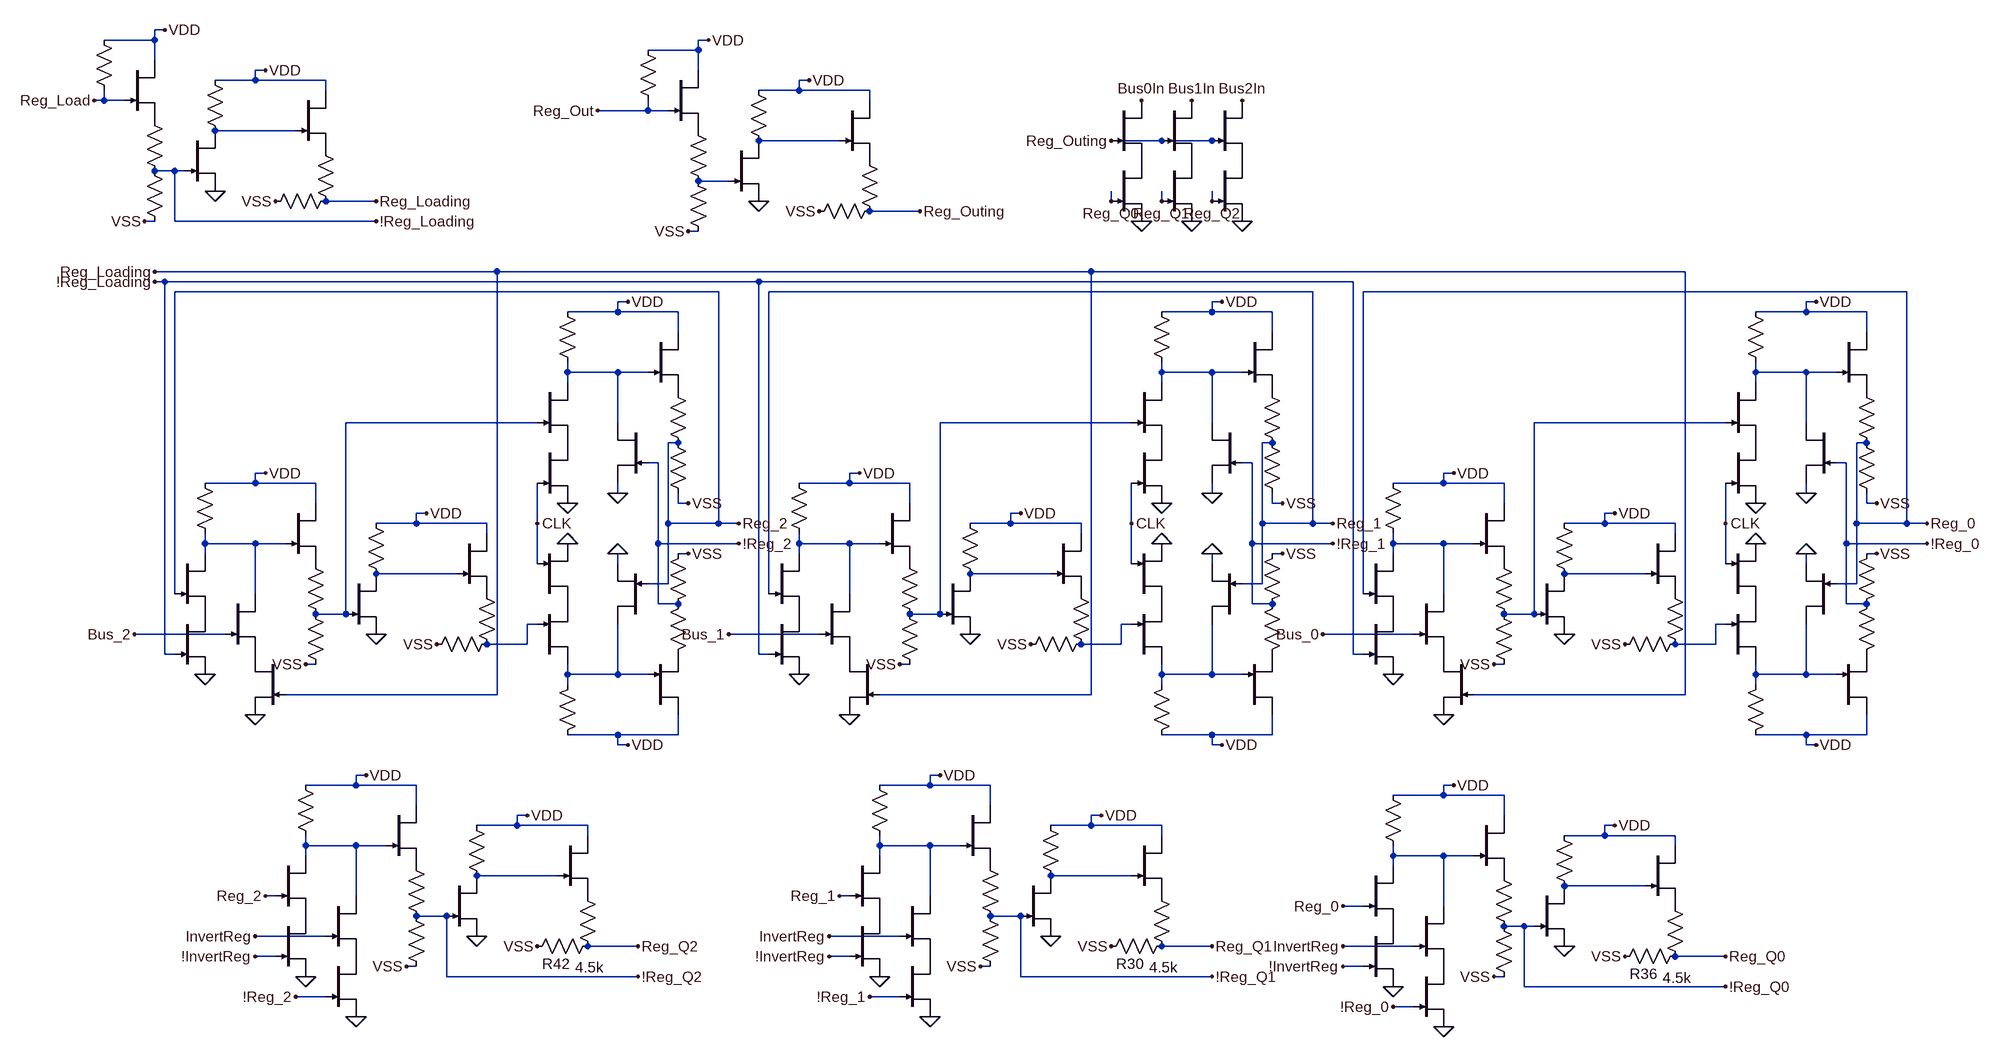
[diagram p0: schematic invertible register 3 bit.asc]
invertible register 3 bit.asc, the LTspice schematic file:
Version 4.1
SHEET 1 109444 42780
WIRE -5680 -1200 -5696 -1200
WIRE -5696 -1184 -5696 -1200
WIRE -5696 -1184 -5776 -1184
WIRE -4816 -1184 -4832 -1184
WIRE -4832 -1168 -4832 -1184
WIRE -4832 -1168 -4912 -1168
WIRE -5696 -1152 -5696 -1184
WIRE -5520 -1136 -5536 -1136
WIRE -4832 -1136 -4832 -1168
WIRE -5536 -1120 -5536 -1136
WIRE -5536 -1120 -5600 -1120
WIRE -5424 -1120 -5536 -1120
WIRE -4656 -1120 -4672 -1120
WIRE -5424 -1104 -5424 -1120
WIRE -4672 -1104 -4672 -1120
WIRE -4672 -1104 -4736 -1104
WIRE -4560 -1104 -4672 -1104
WIRE -5776 -1088 -5776 -1104
WIRE -5776 -1088 -5792 -1088
WIRE -5744 -1088 -5776 -1088
WIRE -4560 -1088 -4560 -1104
WIRE -4912 -1072 -4912 -1088
WIRE -4912 -1072 -4992 -1072
WIRE -4880 -1072 -4912 -1072
WIRE -5472 -1040 -5600 -1040
WIRE -4608 -1024 -4736 -1024
WIRE -4096 -1024 -4176 -1024
WIRE -4016 -1024 -4096 -1024
WIRE -4000 -1024 -4016 -1024
WIRE -5664 -976 -5696 -976
WIRE -5648 -976 -5664 -976
WIRE -4784 -960 -4832 -960
WIRE -5344 -928 -5424 -928
WIRE -4176 -928 -4176 -944
WIRE -4096 -928 -4096 -944
WIRE -4016 -928 -4016 -944
WIRE -4480 -912 -4560 -912
WIRE -5696 -896 -5712 -896
WIRE -5664 -896 -5664 -976
WIRE -5344 -896 -5664 -896
WIRE -4832 -880 -4848 -880
WIRE -5152 -816 -5696 -816
WIRE -4208 -816 -5152 -816
WIRE -3264 -816 -4208 -816
WIRE -5680 -800 -5696 -800
WIRE -4736 -800 -5680 -800
WIRE -3792 -800 -4736 -800
WIRE -4800 -784 -5664 -784
WIRE -3856 -784 -4720 -784
WIRE -2912 -784 -3776 -784
WIRE -4944 -768 -4960 -768
WIRE -4000 -768 -4016 -768
WIRE -3056 -768 -3072 -768
WIRE -4960 -752 -4960 -768
WIRE -4960 -752 -5040 -752
WIRE -4864 -752 -4960 -752
WIRE -4016 -752 -4016 -768
WIRE -4016 -752 -4096 -752
WIRE -3920 -752 -4016 -752
WIRE -3072 -752 -3072 -768
WIRE -3072 -752 -3152 -752
WIRE -2976 -752 -3072 -752
WIRE -4864 -720 -4864 -752
WIRE -3920 -720 -3920 -752
WIRE -2976 -720 -2976 -752
WIRE -5040 -656 -5040 -672
WIRE -4960 -656 -5040 -656
WIRE -4912 -656 -4960 -656
WIRE -4096 -656 -4096 -672
WIRE -4016 -656 -4096 -656
WIRE -3968 -656 -4016 -656
WIRE -3152 -656 -3152 -672
WIRE -3072 -656 -3152 -656
WIRE -3024 -656 -3072 -656
WIRE -5040 -640 -5040 -656
WIRE -4096 -640 -4096 -656
WIRE -3152 -640 -3152 -656
WIRE -5088 -576 -5392 -576
WIRE -4960 -576 -4960 -656
WIRE -4144 -576 -4448 -576
WIRE -4016 -576 -4016 -656
WIRE -3200 -576 -3504 -576
WIRE -3072 -576 -3072 -656
WIRE -4864 -544 -4880 -544
WIRE -3920 -544 -3936 -544
WIRE -2976 -544 -2992 -544
WIRE -4896 -512 -4912 -512
WIRE -3952 -512 -3968 -512
WIRE -3008 -512 -3024 -512
WIRE -5520 -496 -5536 -496
WIRE -4576 -496 -4592 -496
WIRE -3632 -496 -3648 -496
WIRE -5536 -480 -5536 -496
WIRE -5536 -480 -5616 -480
WIRE -5440 -480 -5536 -480
WIRE -4592 -480 -4592 -496
WIRE -4592 -480 -4672 -480
WIRE -4496 -480 -4592 -480
WIRE -3648 -480 -3648 -496
WIRE -3648 -480 -3728 -480
WIRE -3552 -480 -3648 -480
WIRE -4960 -464 -4960 -480
WIRE -4016 -464 -4016 -480
WIRE -3072 -464 -3072 -480
WIRE -5440 -448 -5440 -480
WIRE -4864 -448 -4864 -464
WIRE -4848 -448 -4864 -448
WIRE -4496 -448 -4496 -480
WIRE -3920 -448 -3920 -464
WIRE -3904 -448 -3920 -448
WIRE -3552 -448 -3552 -480
WIRE -2976 -448 -2976 -464
WIRE -2960 -448 -2976 -448
WIRE -5264 -432 -5280 -432
WIRE -4320 -432 -4336 -432
WIRE -3376 -432 -3392 -432
WIRE -5280 -416 -5280 -432
WIRE -5280 -416 -5344 -416
WIRE -5168 -416 -5280 -416
WIRE -5088 -416 -5088 -480
WIRE -4880 -416 -4880 -544
WIRE -4800 -416 -4800 -784
WIRE -4800 -416 -4880 -416
WIRE -4768 -416 -4800 -416
WIRE -4336 -416 -4336 -432
WIRE -4336 -416 -4400 -416
WIRE -4224 -416 -4336 -416
WIRE -4144 -416 -4144 -480
WIRE -3936 -416 -3936 -544
WIRE -3856 -416 -3856 -784
WIRE -3856 -416 -3936 -416
WIRE -3824 -416 -3856 -416
WIRE -3392 -416 -3392 -432
WIRE -3392 -416 -3456 -416
WIRE -3280 -416 -3392 -416
WIRE -3200 -416 -3200 -480
WIRE -2992 -416 -2992 -544
WIRE -2912 -416 -2912 -784
WIRE -2912 -416 -2992 -416
WIRE -2880 -416 -2912 -416
WIRE -5168 -400 -5168 -416
WIRE -4224 -400 -4224 -416
WIRE -3280 -400 -3280 -416
WIRE -5616 -384 -5616 -400
WIRE -5536 -384 -5616 -384
WIRE -5488 -384 -5536 -384
WIRE -4896 -384 -4896 -512
WIRE -4768 -384 -4896 -384
WIRE -4672 -384 -4672 -400
WIRE -4592 -384 -4672 -384
WIRE -4544 -384 -4592 -384
WIRE -3952 -384 -3952 -512
WIRE -3824 -384 -3952 -384
WIRE -3728 -384 -3728 -400
WIRE -3648 -384 -3728 -384
WIRE -3600 -384 -3648 -384
WIRE -3008 -384 -3008 -512
WIRE -2880 -384 -3008 -384
WIRE -5616 -368 -5616 -384
WIRE -4848 -368 -4864 -368
WIRE -4672 -368 -4672 -384
WIRE -3904 -368 -3920 -368
WIRE -3728 -368 -3728 -384
WIRE -2960 -368 -2976 -368
WIRE -5088 -352 -5088 -416
WIRE -4960 -352 -4960 -368
WIRE -4144 -352 -4144 -416
WIRE -4016 -352 -4016 -368
WIRE -3200 -352 -3200 -416
WIRE -3072 -352 -3072 -368
WIRE -5216 -336 -5344 -336
WIRE -4272 -336 -4400 -336
WIRE -3328 -336 -3456 -336
WIRE -4880 -320 -4880 -416
WIRE -4880 -320 -4912 -320
WIRE -3936 -320 -3936 -416
WIRE -3936 -320 -3968 -320
WIRE -2992 -320 -2992 -416
WIRE -2992 -320 -3024 -320
WIRE -5664 -304 -5664 -784
WIRE -5536 -304 -5536 -384
WIRE -4720 -304 -4720 -784
WIRE -4592 -304 -4592 -384
WIRE -3776 -304 -3776 -784
WIRE -3648 -304 -3648 -384
WIRE -4896 -288 -4896 -384
WIRE -4864 -288 -4896 -288
WIRE -3952 -288 -3952 -384
WIRE -3920 -288 -3952 -288
WIRE -3008 -288 -3008 -384
WIRE -2976 -288 -3008 -288
WIRE -5392 -272 -5392 -576
WIRE -5392 -272 -5440 -272
WIRE -4448 -272 -4448 -576
WIRE -4448 -272 -4496 -272
WIRE -3504 -272 -3504 -576
WIRE -3504 -272 -3552 -272
WIRE -5088 -256 -5104 -256
WIRE -4144 -256 -4160 -256
WIRE -3200 -256 -3216 -256
WIRE -5584 -240 -5728 -240
WIRE -4640 -240 -4784 -240
WIRE -3696 -240 -3840 -240
WIRE -5104 -224 -5104 -256
WIRE -5104 -224 -5168 -224
WIRE -4160 -224 -4160 -256
WIRE -4160 -224 -4224 -224
WIRE -3216 -224 -3216 -256
WIRE -3216 -224 -3280 -224
WIRE -5680 -208 -5680 -800
WIRE -5664 -208 -5680 -208
WIRE -4736 -208 -4736 -800
WIRE -4720 -208 -4736 -208
WIRE -3792 -208 -3792 -800
WIRE -3776 -208 -3792 -208
WIRE -5440 -192 -5456 -192
WIRE -4496 -192 -4512 -192
WIRE -3552 -192 -3568 -192
WIRE -5040 -176 -5040 -192
WIRE -4960 -176 -4960 -256
WIRE -4960 -176 -5040 -176
WIRE -4912 -176 -4960 -176
WIRE -4096 -176 -4096 -192
WIRE -4016 -176 -4016 -256
WIRE -4016 -176 -4096 -176
WIRE -3968 -176 -4016 -176
WIRE -3152 -176 -3152 -192
WIRE -3072 -176 -3072 -256
WIRE -3072 -176 -3152 -176
WIRE -3024 -176 -3072 -176
WIRE -5040 -160 -5040 -176
WIRE -4096 -160 -4096 -176
WIRE -3152 -160 -3152 -176
WIRE -5152 -144 -5152 -816
WIRE -5152 -144 -5488 -144
WIRE -4208 -144 -4208 -816
WIRE -4208 -144 -4544 -144
WIRE -3264 -144 -3264 -816
WIRE -3264 -144 -3600 -144
WIRE -4960 -80 -5040 -80
WIRE -4864 -80 -4864 -112
WIRE -4864 -80 -4960 -80
WIRE -4016 -80 -4096 -80
WIRE -3920 -80 -3920 -112
WIRE -3920 -80 -4016 -80
WIRE -3072 -80 -3152 -80
WIRE -2976 -80 -2976 -112
WIRE -2976 -80 -3072 -80
WIRE -4960 -64 -4960 -80
WIRE -4944 -64 -4960 -64
WIRE -4016 -64 -4016 -80
WIRE -4000 -64 -4016 -64
WIRE -3072 -64 -3072 -80
WIRE -3056 -64 -3072 -64
WIRE -5360 -16 -5376 -16
WIRE -4448 -16 -4464 -16
WIRE -5376 0 -5376 -16
WIRE -5376 0 -5456 0
WIRE -5280 0 -5376 0
WIRE -4464 0 -4464 -16
WIRE -4464 0 -4544 0
WIRE -4368 0 -4464 0
WIRE -3632 0 -3648 0
WIRE -3648 16 -3648 0
WIRE -3648 16 -3728 16
WIRE -3552 16 -3648 16
WIRE -5280 32 -5280 0
WIRE -4368 32 -4368 0
WIRE -5104 48 -5120 48
WIRE -4192 48 -4208 48
WIRE -3552 48 -3552 16
WIRE -5120 64 -5120 48
WIRE -5120 64 -5184 64
WIRE -5008 64 -5120 64
WIRE -4208 64 -4208 48
WIRE -4208 64 -4272 64
WIRE -4096 64 -4208 64
WIRE -3376 64 -3392 64
WIRE -5008 80 -5008 64
WIRE -4096 80 -4096 64
WIRE -3392 80 -3392 64
WIRE -3392 80 -3456 80
WIRE -3280 80 -3392 80
WIRE -5456 96 -5456 80
WIRE -5376 96 -5456 96
WIRE -5328 96 -5376 96
WIRE -4544 96 -4544 80
WIRE -4464 96 -4544 96
WIRE -4416 96 -4464 96
WIRE -3280 96 -3280 80
WIRE -5456 112 -5456 96
WIRE -4544 112 -4544 96
WIRE -3728 112 -3728 96
WIRE -3648 112 -3728 112
WIRE -3600 112 -3648 112
WIRE -3728 128 -3728 112
WIRE -5056 144 -5184 144
WIRE -4144 144 -4272 144
WIRE -3328 160 -3456 160
WIRE -5504 176 -5520 176
WIRE -5376 176 -5376 96
WIRE -4592 176 -4608 176
WIRE -4464 176 -4464 96
WIRE -3776 192 -3808 192
WIRE -3648 192 -3648 112
WIRE -5232 208 -5280 208
WIRE -4320 208 -4368 208
WIRE -3520 224 -3552 224
WIRE -3504 224 -3520 224
WIRE -5424 240 -5536 240
WIRE -4512 240 -4624 240
WIRE -4928 256 -5008 256
WIRE -4016 256 -4096 256
WIRE -3696 256 -3808 256
WIRE -5504 272 -5536 272
WIRE -4592 272 -4624 272
WIRE -3200 272 -3280 272
WIRE -5280 288 -5296 288
WIRE -4368 288 -4384 288
WIRE -3776 288 -3808 288
WIRE -5232 304 -5232 208
WIRE -4928 304 -5232 304
WIRE -4320 304 -4320 208
WIRE -4016 304 -4320 304
WIRE -3552 304 -3568 304
WIRE -3520 320 -3520 224
WIRE -3200 320 -3520 320
WIRE -5424 336 -5472 336
WIRE -4512 336 -4560 336
WIRE -3696 352 -3728 352
FLAG -5600 -944 0
FLAG -5680 -1200 VDD
FLAG -5520 -1136 VDD
FLAG -5712 -896 VSS
FLAG -5504 -928 VSS
FLAG -4736 -928 0
FLAG -4816 -1184 VDD
FLAG -4656 -1120 VDD
FLAG -4848 -880 VSS
FLAG -4640 -912 VSS
FLAG -4944 -768 VDD
FLAG -4944 -64 VDD
FLAG -4848 -368 VSS
FLAG -5040 -384 0
FLAG -5040 -448 0
FLAG -4960 -464 0
FLAG -4960 -368 0
FLAG -4848 -448 VSS
FLAG -5088 -416 CLK
FLAG -5536 -112 0
FLAG -5616 -176 0
FLAG -5344 -240 0
FLAG -5520 -496 VDD
FLAG -5264 -432 VDD
FLAG -5456 -192 VSS
FLAG -5248 -224 VSS
FLAG -5728 -240 Bus_2
FLAG -5696 -816 Reg_Loading
FLAG -5344 -928 Reg_Loading
FLAG -5344 -896 !Reg_Loading
FLAG -5696 -800 !Reg_Loading
FLAG -4768 -416 Reg_2
FLAG -5792 -1088 Reg_Load
FLAG -4992 -1072 Reg_Out
FLAG -4480 -912 Reg_Outing
FLAG -4768 -384 !Reg_2
FLAG -4000 -768 VDD
FLAG -4000 -64 VDD
FLAG -3904 -368 VSS
FLAG -4096 -384 0
FLAG -4096 -448 0
FLAG -4016 -464 0
FLAG -4016 -368 0
FLAG -3904 -448 VSS
FLAG -4144 -416 CLK
FLAG -4592 -112 0
FLAG -4672 -176 0
FLAG -4400 -240 0
FLAG -4576 -496 VDD
FLAG -4320 -432 VDD
FLAG -4512 -192 VSS
FLAG -4304 -224 VSS
FLAG -4784 -240 Bus_1
FLAG -3824 -416 Reg_1
FLAG -3824 -384 !Reg_1
FLAG -3056 -768 VDD
FLAG -3056 -64 VDD
FLAG -2960 -368 VSS
FLAG -3152 -384 0
FLAG -3152 -448 0
FLAG -3072 -464 0
FLAG -3072 -368 0
FLAG -2960 -448 VSS
FLAG -3200 -416 CLK
FLAG -3648 -112 0
FLAG -3728 -176 0
FLAG -3456 -240 0
FLAG -3632 -496 VDD
FLAG -3376 -432 VDD
FLAG -3568 -192 VSS
FLAG -3360 -224 VSS
FLAG -3840 -240 Bus_0
FLAG -2880 -416 Reg_0
FLAG -2880 -384 !Reg_0
FLAG -4128 -896 0
FLAG -4128 -1088 Bus0In
FLAG -4176 -1024 Reg_Outing
FLAG -4048 -896 0
FLAG -4048 -1088 Bus1In
FLAG -3968 -896 0
FLAG -3968 -1088 Bus2In
FLAG -4464 368 0
FLAG -4544 304 0
FLAG -4272 240 0
FLAG -4448 -16 VDD
FLAG -4192 48 VDD
FLAG -4384 288 VSS
FLAG -4176 256 VSS
FLAG -4624 240 InvertReg
FLAG -3648 384 0
FLAG -3728 320 0
FLAG -3456 256 0
FLAG -3632 0 VDD
FLAG -3376 64 VDD
FLAG -3568 304 VSS
FLAG -3360 272 VSS
FLAG -3808 288 !InvertReg
FLAG -4608 176 Reg_1
FLAG -4016 256 Reg_Q1
FLAG -3200 272 Reg_Q0
FLAG -3200 320 !Reg_Q0
FLAG -4016 304 !Reg_Q1
FLAG -4560 336 !Reg_1
FLAG -3808 192 Reg_0
FLAG -3728 352 !Reg_0
FLAG -3808 256 InvertReg
FLAG -4624 272 !InvertReg
FLAG -5376 368 0
FLAG -5456 304 0
FLAG -5184 240 0
FLAG -5360 -16 VDD
FLAG -5104 48 VDD
FLAG -5296 288 VSS
FLAG -5088 256 VSS
FLAG -5536 240 InvertReg
FLAG -5520 176 Reg_2
FLAG -4928 256 Reg_Q2
FLAG -4928 304 !Reg_Q2
FLAG -5472 336 !Reg_2
FLAG -5536 272 !InvertReg
FLAG -4176 -928 Reg_Q0
FLAG -4096 -928 Reg_Q1
FLAG -4016 -928 Reg_Q2
SYMBOL res -5792 -1200 R0
WINDOW 0 -35 57 Invisible 2
WINDOW 3 34 56 Invisible 2
SYMATTR InstName R3457
SYMATTR Value 100k
SYMBOL njf -5744 -1152 R0
WINDOW 0 56 32 Invisible 2
WINDOW 3 56 72 Invisible 2
SYMATTR InstName J_F881
SYMATTR Value DR
SYMBOL res -5712 -1072 R0
WINDOW 0 -24 60 Invisible 2
WINDOW 3 34 58 Invisible 2
SYMATTR InstName R3458
SYMATTR Value 1k
SYMBOL res -5712 -992 R0
WINDOW 0 -22 62 Invisible 2
WINDOW 3 37 62 Invisible 2
SYMATTR InstName R3459
SYMATTR Value 4.8k
SYMBOL njf -5648 -1040 R0
WINDOW 0 56 32 Invisible 2
WINDOW 3 56 72 Invisible 2
SYMATTR InstName J_A2131
SYMATTR Value DR
SYMBOL res -5616 -1136 R0
WINDOW 0 56 32 Invisible 2
WINDOW 3 56 72 Invisible 2
SYMATTR InstName R3460
SYMATTR Value 50k
SYMBOL njf -5472 -1104 R0
WINDOW 0 56 32 Invisible 2
WINDOW 3 56 72 Invisible 2
SYMATTR InstName J_A2132
SYMATTR Value DR
SYMBOL res -5440 -1024 R0
WINDOW 0 37 24 Invisible 2
WINDOW 3 -30 25 Invisible 2
SYMATTR InstName R3461
SYMATTR Value 1k
SYMBOL res -5408 -944 R90
WINDOW 0 59 66 Invisible 2
WINDOW 3 34 13 Invisible 2
SYMATTR InstName R3462
SYMATTR Value 4.5k
SYMBOL res -4928 -1184 R0
WINDOW 0 -35 57 Invisible 2
WINDOW 3 34 56 Invisible 2
SYMATTR InstName R3463
SYMATTR Value 100k
SYMBOL njf -4880 -1136 R0
WINDOW 0 56 32 Invisible 2
WINDOW 3 56 72 Invisible 2
SYMATTR InstName J_F882
SYMATTR Value DR
SYMBOL res -4848 -1056 R0
WINDOW 0 -24 60 Invisible 2
WINDOW 3 34 58 Invisible 2
SYMATTR InstName R3464
SYMATTR Value 1k
SYMBOL res -4848 -976 R0
WINDOW 0 -22 62 Invisible 2
WINDOW 3 37 62 Invisible 2
SYMATTR InstName R3465
SYMATTR Value 4.8k
SYMBOL njf -4784 -1024 R0
WINDOW 0 56 32 Invisible 2
WINDOW 3 56 72 Invisible 2
SYMATTR InstName J_A2133
SYMATTR Value DR
SYMBOL res -4752 -1120 R0
WINDOW 0 56 32 Invisible 2
WINDOW 3 56 72 Invisible 2
SYMATTR InstName R3466
SYMATTR Value 50k
SYMBOL njf -4608 -1088 R0
WINDOW 0 56 32 Invisible 2
WINDOW 3 56 72 Invisible 2
SYMATTR InstName J_A2134
SYMATTR Value DR
SYMBOL res -4576 -1008 R0
WINDOW 0 37 24 Invisible 2
WINDOW 3 -30 25 Invisible 2
SYMATTR InstName R3467
SYMATTR Value 1k
SYMBOL res -4544 -928 R90
WINDOW 0 59 66 Invisible 2
WINDOW 3 34 13 Invisible 2
SYMATTR InstName R3468
SYMATTR Value 4.5k
SYMBOL njf -5088 -640 R0
WINDOW 0 56 32 Invisible 2
WINDOW 3 56 72 Invisible 2
SYMATTR InstName J_A2135
SYMATTR Value DR
SYMBOL res -5056 -768 R0
WINDOW 0 -35 57 Invisible 2
WINDOW 3 34 56 Invisible 2
SYMATTR InstName R3469
SYMATTR Value 100k
SYMBOL njf -4912 -720 R0
WINDOW 0 56 32 Invisible 2
WINDOW 3 56 72 Invisible 2
SYMATTR InstName J_F883
SYMATTR Value DR
SYMBOL res -4880 -640 R0
WINDOW 0 -24 60 Invisible 2
WINDOW 3 34 58 Invisible 2
SYMATTR InstName R3470
SYMATTR Value 1k
SYMBOL res -4880 -560 R0
WINDOW 0 -22 62 Invisible 2
WINDOW 3 37 62 Invisible 2
SYMATTR InstName R3471
SYMATTR Value 4.8k
SYMBOL njf -4912 -576 M0
WINDOW 0 11 -7 Invisible 2
WINDOW 3 56 72 Invisible 2
SYMATTR InstName J_B1002
SYMATTR Value DR
SYMBOL njf -5088 -192 M180
WINDOW 0 56 32 Invisible 2
WINDOW 3 56 72 Invisible 2
SYMATTR InstName J_A2136
SYMATTR Value DR
SYMBOL res -5056 -64 M180
WINDOW 0 36 76 Invisible 2
WINDOW 3 36 40 Invisible 2
SYMATTR InstName R3472
SYMATTR Value 100k
SYMBOL njf -4912 -112 M180
WINDOW 0 56 32 Invisible 2
WINDOW 3 56 72 Invisible 2
SYMATTR InstName J_F884
SYMATTR Value DR
SYMBOL res -4880 -192 M180
WINDOW 0 36 76 Invisible 2
WINDOW 3 36 40 Invisible 2
SYMATTR InstName R3473
SYMATTR Value 1k
SYMBOL res -4880 -272 M180
WINDOW 0 36 76 Invisible 2
WINDOW 3 36 40 Invisible 2
SYMATTR InstName R3474
SYMATTR Value 4.8k
SYMBOL njf -4912 -256 R180
WINDOW 0 56 32 Invisible 2
WINDOW 3 56 72 Invisible 2
SYMATTR InstName J_B1003
SYMATTR Value DR
SYMBOL njf -5088 -544 R0
WINDOW 0 56 32 Invisible 2
WINDOW 3 56 72 Invisible 2
SYMATTR InstName J_A2137
SYMATTR Value DR
SYMBOL njf -5088 -288 M180
WINDOW 0 56 32 Invisible 2
WINDOW 3 56 72 Invisible 2
SYMATTR InstName J_A2138
SYMATTR Value DR
SYMBOL njf -5664 -368 R0
WINDOW 0 56 32 Invisible 2
WINDOW 3 56 72 Invisible 2
SYMATTR InstName J_A2139
SYMATTR Value DR
SYMBOL res -5632 -496 R0
WINDOW 0 -35 57 Invisible 2
WINDOW 3 34 56 Invisible 2
SYMATTR InstName R3475
SYMATTR Value 100k
SYMBOL njf -5488 -448 R0
WINDOW 0 56 32 Invisible 2
WINDOW 3 56 72 Invisible 2
SYMATTR InstName J_F885
SYMATTR Value DR
SYMBOL res -5456 -368 R0
WINDOW 0 -24 60 Invisible 2
WINDOW 3 34 58 Invisible 2
SYMATTR InstName R3476
SYMATTR Value 1k
SYMBOL res -5456 -288 R0
WINDOW 0 -22 62 Invisible 2
WINDOW 3 37 62 Invisible 2
SYMATTR InstName R3477
SYMATTR Value 4.8k
SYMBOL njf -5584 -304 R0
WINDOW 0 56 32 Invisible 2
WINDOW 3 56 72 Invisible 2
SYMATTR InstName J_B1004
SYMATTR Value DR
SYMBOL njf -5392 -336 R0
WINDOW 0 56 32 Invisible 2
WINDOW 3 56 72 Invisible 2
SYMATTR InstName J_A2140
SYMATTR Value DR
SYMBOL res -5360 -432 R0
WINDOW 0 56 32 Invisible 2
WINDOW 3 56 72 Invisible 2
SYMATTR InstName R3478
SYMATTR Value 50k
SYMBOL njf -5216 -400 R0
WINDOW 0 56 32 Invisible 2
WINDOW 3 56 72 Invisible 2
SYMATTR InstName J_A2141
SYMATTR Value DR
SYMBOL res -5184 -320 R0
WINDOW 0 37 24 Invisible 2
WINDOW 3 -30 25 Invisible 2
SYMATTR InstName R3479
SYMATTR Value 1k
SYMBOL res -5152 -240 R90
WINDOW 0 59 66 Invisible 2
WINDOW 3 34 13 Invisible 2
SYMATTR InstName R3480
SYMATTR Value 4.5k
SYMBOL njf -5664 -272 R0
WINDOW 0 56 32 Invisible 2
WINDOW 3 56 72 Invisible 2
SYMATTR InstName J_A2142
SYMATTR Value DR
SYMBOL njf -5488 -208 M0
WINDOW 0 56 32 Invisible 2
WINDOW 3 56 72 Invisible 2
SYMATTR InstName J_B1005
SYMATTR Value DR
SYMBOL njf -4144 -640 R0
WINDOW 0 56 32 Invisible 2
WINDOW 3 56 72 Invisible 2
SYMATTR InstName J_A1
SYMATTR Value DR
SYMBOL res -4112 -768 R0
WINDOW 0 -35 57 Invisible 2
WINDOW 3 34 56 Invisible 2
SYMATTR InstName R1
SYMATTR Value 100k
SYMBOL njf -3968 -720 R0
WINDOW 0 56 32 Invisible 2
WINDOW 3 56 72 Invisible 2
SYMATTR InstName J_F1
SYMATTR Value DR
SYMBOL res -3936 -640 R0
WINDOW 0 -24 60 Invisible 2
WINDOW 3 34 58 Invisible 2
SYMATTR InstName R2
SYMATTR Value 1k
SYMBOL res -3936 -560 R0
WINDOW 0 -22 62 Invisible 2
WINDOW 3 37 62 Invisible 2
SYMATTR InstName R3
SYMATTR Value 4.8k
SYMBOL njf -3968 -576 M0
WINDOW 0 11 -7 Invisible 2
WINDOW 3 56 72 Invisible 2
SYMATTR InstName J_B1
SYMATTR Value DR
SYMBOL njf -4144 -192 M180
WINDOW 0 56 32 Invisible 2
WINDOW 3 56 72 Invisible 2
SYMATTR InstName J_A2
SYMATTR Value DR
SYMBOL res -4112 -64 M180
WINDOW 0 36 76 Invisible 2
WINDOW 3 36 40 Invisible 2
SYMATTR InstName R4
SYMATTR Value 100k
SYMBOL njf -3968 -112 M180
WINDOW 0 56 32 Invisible 2
WINDOW 3 56 72 Invisible 2
SYMATTR InstName J_F2
SYMATTR Value DR
SYMBOL res -3936 -192 M180
WINDOW 0 36 76 Invisible 2
WINDOW 3 36 40 Invisible 2
SYMATTR InstName R5
SYMATTR Value 1k
SYMBOL res -3936 -272 M180
WINDOW 0 36 76 Invisible 2
WINDOW 3 36 40 Invisible 2
SYMATTR InstName R6
SYMATTR Value 4.8k
SYMBOL njf -3968 -256 R180
WINDOW 0 56 32 Invisible 2
WINDOW 3 56 72 Invisible 2
SYMATTR InstName J_B2
SYMATTR Value DR
SYMBOL njf -4144 -544 R0
WINDOW 0 56 32 Invisible 2
WINDOW 3 56 72 Invisible 2
SYMATTR InstName J_A3
SYMATTR Value DR
SYMBOL njf -4144 -288 M180
WINDOW 0 56 32 Invisible 2
WINDOW 3 56 72 Invisible 2
SYMATTR InstName J_A4
SYMATTR Value DR
SYMBOL njf -4720 -368 R0
WINDOW 0 56 32 Invisible 2
WINDOW 3 56 72 Invisible 2
SYMATTR InstName J_A5
SYMATTR Value DR
SYMBOL res -4688 -496 R0
WINDOW 0 -35 57 Invisible 2
WINDOW 3 34 56 Invisible 2
SYMATTR InstName R7
SYMATTR Value 100k
SYMBOL njf -4544 -448 R0
WINDOW 0 56 32 Invisible 2
WINDOW 3 56 72 Invisible 2
SYMATTR InstName J_F3
SYMATTR Value DR
SYMBOL res -4512 -368 R0
WINDOW 0 -24 60 Invisible 2
WINDOW 3 34 58 Invisible 2
SYMATTR InstName R8
SYMATTR Value 1k
SYMBOL res -4512 -288 R0
WINDOW 0 -22 62 Invisible 2
WINDOW 3 37 62 Invisible 2
SYMATTR InstName R9
SYMATTR Value 4.8k
SYMBOL njf -4640 -304 R0
WINDOW 0 56 32 Invisible 2
WINDOW 3 56 72 Invisible 2
SYMATTR InstName J_B3
SYMATTR Value DR
SYMBOL njf -4448 -336 R0
WINDOW 0 56 32 Invisible 2
WINDOW 3 56 72 Invisible 2
SYMATTR InstName J_A6
SYMATTR Value DR
SYMBOL res -4416 -432 R0
WINDOW 0 56 32 Invisible 2
WINDOW 3 56 72 Invisible 2
SYMATTR InstName R10
SYMATTR Value 50k
SYMBOL njf -4272 -400 R0
WINDOW 0 56 32 Invisible 2
WINDOW 3 56 72 Invisible 2
SYMATTR InstName J_A7
SYMATTR Value DR
SYMBOL res -4240 -320 R0
WINDOW 0 37 24 Invisible 2
WINDOW 3 -30 25 Invisible 2
SYMATTR InstName R11
SYMATTR Value 1k
SYMBOL res -4208 -240 R90
WINDOW 0 59 66 Invisible 2
WINDOW 3 34 13 Invisible 2
SYMATTR InstName R12
SYMATTR Value 4.5k
SYMBOL njf -4720 -272 R0
WINDOW 0 56 32 Invisible 2
WINDOW 3 56 72 Invisible 2
SYMATTR InstName J_A8
SYMATTR Value DR
SYMBOL njf -4544 -208 M0
WINDOW 0 56 32 Invisible 2
WINDOW 3 56 72 Invisible 2
SYMATTR InstName J_B4
SYMATTR Value DR
SYMBOL njf -3200 -640 R0
WINDOW 0 56 32 Invisible 2
WINDOW 3 56 72 Invisible 2
SYMATTR InstName J_A9
SYMATTR Value DR
SYMBOL res -3168 -768 R0
WINDOW 0 -35 57 Invisible 2
WINDOW 3 34 56 Invisible 2
SYMATTR InstName R13
SYMATTR Value 100k
SYMBOL njf -3024 -720 R0
WINDOW 0 56 32 Invisible 2
WINDOW 3 56 72 Invisible 2
SYMATTR InstName J_F4
SYMATTR Value DR
SYMBOL res -2992 -640 R0
WINDOW 0 -24 60 Invisible 2
WINDOW 3 34 58 Invisible 2
SYMATTR InstName R14
SYMATTR Value 1k
SYMBOL res -2992 -560 R0
WINDOW 0 -22 62 Invisible 2
WINDOW 3 37 62 Invisible 2
SYMATTR InstName R15
SYMATTR Value 4.8k
SYMBOL njf -3024 -576 M0
WINDOW 0 11 -7 Invisible 2
WINDOW 3 56 72 Invisible 2
SYMATTR InstName J_B5
SYMATTR Value DR
SYMBOL njf -3200 -192 M180
WINDOW 0 56 32 Invisible 2
WINDOW 3 56 72 Invisible 2
SYMATTR InstName J_A10
SYMATTR Value DR
SYMBOL res -3168 -64 M180
WINDOW 0 36 76 Invisible 2
WINDOW 3 36 40 Invisible 2
SYMATTR InstName R16
SYMATTR Value 100k
SYMBOL njf -3024 -112 M180
WINDOW 0 56 32 Invisible 2
WINDOW 3 56 72 Invisible 2
SYMATTR InstName J_F5
SYMATTR Value DR
SYMBOL res -2992 -192 M180
WINDOW 0 36 76 Invisible 2
WINDOW 3 36 40 Invisible 2
SYMATTR InstName R17
SYMATTR Value 1k
SYMBOL res -2992 -272 M180
WINDOW 0 36 76 Invisible 2
WINDOW 3 36 40 Invisible 2
SYMATTR InstName R18
SYMATTR Value 4.8k
SYMBOL njf -3024 -256 R180
WINDOW 0 56 32 Invisible 2
WINDOW 3 56 72 Invisible 2
SYMATTR InstName J_B6
SYMATTR Value DR
SYMBOL njf -3200 -544 R0
WINDOW 0 56 32 Invisible 2
WINDOW 3 56 72 Invisible 2
SYMATTR InstName J_A11
SYMATTR Value DR
SYMBOL njf -3200 -288 M180
WINDOW 0 56 32 Invisible 2
WINDOW 3 56 72 Invisible 2
SYMATTR InstName J_A12
SYMATTR Value DR
SYMBOL njf -3776 -368 R0
WINDOW 0 56 32 Invisible 2
WINDOW 3 56 72 Invisible 2
SYMATTR InstName J_A13
SYMATTR Value DR
SYMBOL res -3744 -496 R0
WINDOW 0 -35 57 Invisible 2
WINDOW 3 34 56 Invisible 2
SYMATTR InstName R19
SYMATTR Value 100k
SYMBOL njf -3600 -448 R0
WINDOW 0 56 32 Invisible 2
WINDOW 3 56 72 Invisible 2
SYMATTR InstName J_F6
SYMATTR Value DR
SYMBOL res -3568 -368 R0
WINDOW 0 -24 60 Invisible 2
WINDOW 3 34 58 Invisible 2
SYMATTR InstName R20
SYMATTR Value 1k
SYMBOL res -3568 -288 R0
WINDOW 0 -22 62 Invisible 2
WINDOW 3 37 62 Invisible 2
SYMATTR InstName R21
SYMATTR Value 4.8k
SYMBOL njf -3696 -304 R0
WINDOW 0 56 32 Invisible 2
WINDOW 3 56 72 Invisible 2
SYMATTR InstName J_B7
SYMATTR Value DR
SYMBOL njf -3504 -336 R0
WINDOW 0 56 32 Invisible 2
WINDOW 3 56 72 Invisible 2
SYMATTR InstName J_A14
SYMATTR Value DR
SYMBOL res -3472 -432 R0
WINDOW 0 56 32 Invisible 2
WINDOW 3 56 72 Invisible 2
SYMATTR InstName R22
SYMATTR Value 50k
SYMBOL njf -3328 -400 R0
WINDOW 0 56 32 Invisible 2
WINDOW 3 56 72 Invisible 2
SYMATTR InstName J_A15
SYMATTR Value DR
SYMBOL res -3296 -320 R0
WINDOW 0 37 24 Invisible 2
WINDOW 3 -30 25 Invisible 2
SYMATTR InstName R23
SYMATTR Value 1k
SYMBOL res -3264 -240 R90
WINDOW 0 59 66 Invisible 2
WINDOW 3 34 13 Invisible 2
SYMATTR InstName R24
SYMATTR Value 4.5k
SYMBOL njf -3776 -272 R0
WINDOW 0 56 32 Invisible 2
WINDOW 3 56 72 Invisible 2
SYMATTR InstName J_A16
SYMATTR Value DR
SYMBOL njf -3600 -208 M0
WINDOW 0 56 32 Invisible 2
WINDOW 3 56 72 Invisible 2
SYMATTR InstName J_B8
SYMATTR Value DR
SYMBOL njf -4176 -992 R0
WINDOW 0 56 32 Invisible 2
WINDOW 3 56 72 Invisible 2
SYMATTR InstName J_A23
SYMATTR Value DR
SYMBOL njf -4176 -1088 R0
WINDOW 0 56 32 Invisible 2
WINDOW 3 56 72 Invisible 2
SYMATTR InstName J_A24
SYMATTR Value DR
SYMBOL njf -4096 -992 R0
WINDOW 0 56 32 Invisible 2
WINDOW 3 56 72 Invisible 2
SYMATTR InstName J_A17
SYMATTR Value DR
SYMBOL njf -4096 -1088 R0
WINDOW 0 56 32 Invisible 2
WINDOW 3 56 72 Invisible 2
SYMATTR InstName J_A18
SYMATTR Value DR
SYMBOL njf -4016 -992 R0
WINDOW 0 56 32 Invisible 2
WINDOW 3 56 72 Invisible 2
SYMATTR InstName J_A21
SYMATTR Value DR
SYMBOL njf -4016 -1088 R0
WINDOW 0 56 32 Invisible 2
WINDOW 3 56 72 Invisible 2
SYMATTR InstName J_A22
SYMATTR Value DR
SYMBOL njf -4592 112 R0
WINDOW 0 56 32 Invisible 2
WINDOW 3 56 72 Invisible 2
SYMATTR InstName J_A19
SYMATTR Value DR
SYMBOL res -4560 -16 R0
WINDOW 0 -35 57 Invisible 2
WINDOW 3 34 56 Invisible 2
SYMATTR InstName R25
SYMATTR Value 100k
SYMBOL njf -4416 32 R0
WINDOW 0 56 32 Invisible 2
WINDOW 3 56 72 Invisible 2
SYMATTR InstName J_F7
SYMATTR Value DR
SYMBOL res -4384 112 R0
WINDOW 0 -24 60 Invisible 2
WINDOW 3 34 58 Invisible 2
SYMATTR InstName R26
SYMATTR Value 1k
SYMBOL res -4384 192 R0
WINDOW 0 -31 62 Invisible 2
WINDOW 3 37 62 Invisible 2
SYMATTR InstName R27
SYMATTR Value 4.8k
SYMBOL njf -4512 176 R0
WINDOW 0 56 32 Invisible 2
WINDOW 3 56 72 Invisible 2
SYMATTR InstName J_B9
SYMATTR Value DR
SYMBOL njf -4320 144 R0
WINDOW 0 56 32 Invisible 2
WINDOW 3 56 72 Invisible 2
SYMATTR InstName J_A20
SYMATTR Value DR
SYMBOL res -4288 48 R0
WINDOW 0 56 32 Invisible 2
WINDOW 3 56 72 Invisible 2
SYMATTR InstName R28
SYMATTR Value 50k
SYMBOL njf -4144 80 R0
WINDOW 0 56 32 Invisible 2
WINDOW 3 56 72 Invisible 2
SYMATTR InstName J_A25
SYMATTR Value DR
SYMBOL res -4112 160 R0
WINDOW 0 37 24 Invisible 2
WINDOW 3 -30 25 Invisible 2
SYMATTR InstName R29
SYMATTR Value 1k
SYMBOL res -4080 240 R90
WINDOW 0 59 66 VBottom 2
WINDOW 3 34 13 VTop 2
SYMATTR InstName R30
SYMATTR Value 4.5k
SYMBOL njf -4592 208 R0
WINDOW 0 57 49 Invisible 2
WINDOW 3 56 72 Invisible 2
SYMATTR InstName J_A26
SYMATTR Value DR
SYMBOL njf -4512 272 R0
WINDOW 0 56 32 Invisible 2
WINDOW 3 56 72 Invisible 2
SYMATTR InstName J_B10
SYMATTR Value DR
SYMBOL njf -3776 128 R0
WINDOW 0 56 32 Invisible 2
WINDOW 3 56 72 Invisible 2
SYMATTR InstName J_A27
SYMATTR Value DR
SYMBOL res -3744 0 R0
WINDOW 0 -35 57 Invisible 2
WINDOW 3 34 56 Invisible 2
SYMATTR InstName R31
SYMATTR Value 100k
SYMBOL njf -3600 48 R0
WINDOW 0 56 32 Invisible 2
WINDOW 3 56 72 Invisible 2
SYMATTR InstName J_F8
SYMATTR Value DR
SYMBOL res -3568 128 R0
WINDOW 0 -24 60 Invisible 2
WINDOW 3 34 58 Invisible 2
SYMATTR InstName R32
SYMATTR Value 1k
SYMBOL res -3568 208 R0
WINDOW 0 -31 62 Invisible 2
WINDOW 3 37 62 Invisible 2
SYMATTR InstName R33
SYMATTR Value 4.8k
SYMBOL njf -3696 192 R0
WINDOW 0 56 32 Invisible 2
WINDOW 3 56 72 Invisible 2
SYMATTR InstName J_B11
SYMATTR Value DR
SYMBOL njf -3504 160 R0
WINDOW 0 56 32 Invisible 2
WINDOW 3 56 72 Invisible 2
SYMATTR InstName J_A28
SYMATTR Value DR
SYMBOL res -3472 64 R0
WINDOW 0 56 32 Invisible 2
WINDOW 3 56 72 Invisible 2
SYMATTR InstName R34
SYMATTR Value 50k
SYMBOL njf -3328 96 R0
WINDOW 0 56 32 Invisible 2
WINDOW 3 56 72 Invisible 2
SYMATTR InstName J_A29
SYMATTR Value DR
SYMBOL res -3296 176 R0
WINDOW 0 37 24 Invisible 2
WINDOW 3 -30 25 Invisible 2
SYMATTR InstName R35
SYMATTR Value 1k
SYMBOL res -3264 256 R90
WINDOW 0 59 66 VBottom 2
WINDOW 3 34 13 VTop 2
SYMATTR InstName R36
SYMATTR Value 4.5k
SYMBOL njf -3776 224 R0
WINDOW 0 57 49 Invisible 2
WINDOW 3 56 72 Invisible 2
SYMATTR InstName J_A30
SYMATTR Value DR
SYMBOL njf -3696 288 R0
WINDOW 0 56 32 Invisible 2
WINDOW 3 56 72 Invisible 2
SYMATTR InstName J_B12
SYMATTR Value DR
SYMBOL njf -5504 112 R0
WINDOW 0 56 32 Invisible 2
WINDOW 3 56 72 Invisible 2
SYMATTR InstName J_A31
SYMATTR Value DR
SYMBOL res -5472 -16 R0
WINDOW 0 -35 57 Invisible 2
WINDOW 3 34 56 Invisible 2
SYMATTR InstName R37
SYMATTR Value 100k
SYMBOL njf -5328 32 R0
WINDOW 0 56 32 Invisible 2
WINDOW 3 56 72 Invisible 2
SYMATTR InstName J_F9
SYMATTR Value DR
SYMBOL res -5296 112 R0
WINDOW 0 -24 60 Invisible 2
WINDOW 3 34 58 Invisible 2
SYMATTR InstName R38
SYMATTR Value 1k
SYMBOL res -5296 192 R0
WINDOW 0 -31 62 Invisible 2
WINDOW 3 37 62 Invisible 2
SYMATTR InstName R39
SYMATTR Value 4.8k
SYMBOL njf -5424 176 R0
WINDOW 0 56 32 Invisible 2
WINDOW 3 56 72 Invisible 2
SYMATTR InstName J_B13
SYMATTR Value DR
SYMBOL njf -5232 144 R0
WINDOW 0 56 32 Invisible 2
WINDOW 3 56 72 Invisible 2
SYMATTR InstName J_A32
SYMATTR Value DR
SYMBOL res -5200 48 R0
WINDOW 0 56 32 Invisible 2
WINDOW 3 56 72 Invisible 2
SYMATTR InstName R40
SYMATTR Value 50k
SYMBOL njf -5056 80 R0
WINDOW 0 56 32 Invisible 2
WINDOW 3 56 72 Invisible 2
SYMATTR InstName J_A33
SYMATTR Value DR
SYMBOL res -5024 160 R0
WINDOW 0 37 24 Invisible 2
WINDOW 3 -30 25 Invisible 2
SYMATTR InstName R41
SYMATTR Value 1k
SYMBOL res -4992 240 R90
WINDOW 0 59 66 VBottom 2
WINDOW 3 34 13 VTop 2
SYMATTR InstName R42
SYMATTR Value 4.5k
SYMBOL njf -5504 208 R0
WINDOW 0 57 49 Invisible 2
WINDOW 3 56 72 Invisible 2
SYMATTR InstName J_A34
SYMATTR Value DR
SYMBOL njf -5424 272 R0
WINDOW 0 56 32 Invisible 2
WINDOW 3 56 72 Invisible 2
SYMATTR InstName J_B14
SYMATTR Value DR

The netlist it stands for:
* invertible register 3 bit.asc
R3457 VDD Reg_Load 100k
J_F881 VDD Reg_Load P001 DR
R3458 P001 !Reg_Loading 1k
R3459 !Reg_Loading VSS 4.8k
J_A2131 N001 !Reg_Loading 0 DR
R3460 VDD N001 50k
J_A2132 VDD N001 P002 DR
R3461 P002 Reg_Loading 1k
R3462 Reg_Loading VSS 4.5k
R3463 VDD Reg_Out 100k
J_F882 VDD Reg_Out P003 DR
R3464 P003 N003 1k
R3465 N003 VSS 4.8k
J_A2133 N002 N003 0 DR
R3466 VDD N002 50k
J_A2134 VDD N002 P004 DR
R3467 P004 Reg_Outing 1k
R3468 Reg_Outing VSS 4.5k
J_A2135 N004 N007 P005 DR
R3469 VDD N004 100k
J_F883 VDD N004 P006 DR
R3470 P006 Reg_2 1k
R3471 Reg_2 VSS 4.8k
J_B1002 N004 !Reg_2 0 DR
J_A2136 N019 N016 P007 DR
R3472 VDD N019 100k
J_F884 VDD N019 P008 DR
R3473 P008 !Reg_2 1k
R3474 !Reg_2 VSS 4.8k
J_B1003 N019 Reg_2 0 DR
J_A2137 P005 CLK 0 DR
J_A2138 P007 CLK 0 DR
J_A2139 N010 Reg_2 P009 DR
R3475 VDD N010 100k
J_F885 VDD N010 P010 DR
R3476 P010 N007 1k
R3477 N007 VSS 4.8k
J_B1004 N010 Bus_2 P011 DR
J_A2140 N013 N007 0 DR
R3478 VDD N013 50k
J_A2141 VDD N013 P012 DR
R3479 P012 N016 1k
R3480 N016 VSS 4.5k
J_A2142 P009 !Reg_Loading 0 DR
J_B1005 P011 Reg_Loading 0 DR
J_A1 N005 N008 P013 DR
R1 VDD N005 100k
J_F1 VDD N005 P014 DR
R2 P014 Reg_1 1k
R3 Reg_1 VSS 4.8k
J_B1 N005 !Reg_1 0 DR
J_A2 N020 N017 P015 DR
R4 VDD N020 100k
J_F2 VDD N020 P016 DR
R5 P016 !Reg_1 1k
R6 !Reg_1 VSS 4.8k
J_B2 N020 Reg_1 0 DR
J_A3 P013 CLK 0 DR
J_A4 P015 CLK 0 DR
J_A5 N011 Reg_1 P017 DR
R7 VDD N011 100k
J_F3 VDD N011 P018 DR
R8 P018 N008 1k
R9 N008 VSS 4.8k
J_B3 N011 Bus_1 P019 DR
J_A6 N014 N008 0 DR
R10 VDD N014 50k
J_A7 VDD N014 P020 DR
R11 P020 N017 1k
R12 N017 VSS 4.5k
J_A8 P017 !Reg_Loading 0 DR
J_B4 P019 Reg_Loading 0 DR
J_A9 N006 N009 P021 DR
R13 VDD N006 100k
J_F4 VDD N006 P022 DR
R14 P022 Reg_0 1k
R15 Reg_0 VSS 4.8k
J_B5 N006 !Reg_0 0 DR
J_A10 N021 N018 P023 DR
R16 VDD N021 100k
J_F5 VDD N021 P024 DR
R17 P024 !Reg_0 1k
R18 !Reg_0 VSS 4.8k
J_B6 N021 Reg_0 0 DR
J_A11 P021 CLK 0 DR
J_A12 P023 CLK 0 DR
J_A13 N012 Reg_0 P025 DR
R19 VDD N012 100k
J_F6 VDD N012 P026 DR
R20 P026 N009 1k
R21 N009 VSS 4.8k
J_B7 N012 Bus_0 P027 DR
J_A14 N015 N009 0 DR
R22 VDD N015 50k
J_A15 VDD N015 P028 DR
R23 P028 N018 1k
R24 N018 VSS 4.5k
J_A16 P025 !Reg_Loading 0 DR
J_B8 P027 Reg_Loading 0 DR
J_A23 P029 Reg_Q0 0 DR
J_A24 Bus0In Reg_Outing P029 DR
J_A17 P030 Reg_Q1 0 DR
J_A18 Bus1In Reg_Outing P030 DR
J_A21 P031 Reg_Q2 0 DR
J_A22 Bus2In Reg_Outing P031 DR
J_A19 N023 Reg_1 P032 DR
R25 VDD N023 100k
J_F7 VDD N023 P033 DR
R26 P033 !Reg_Q1 1k
R27 !Reg_Q1 VSS 4.8k
J_B9 N023 InvertReg P034 DR
J_A20 N026 !Reg_Q1 0 DR
R28 VDD N026 50k
J_A25 VDD N026 P035 DR
R29 P035 Reg_Q1 1k
R30 Reg_Q1 VSS 4.5k
J_A26 P032 !InvertReg 0 DR
J_B10 P034 !Reg_1 0 DR
J_A27 N024 Reg_0 P036 DR
R31 VDD N024 100k
J_F8 VDD N024 P037 DR
R32 P037 !Reg_Q0 1k
R33 !Reg_Q0 VSS 4.8k
J_B11 N024 InvertReg P038 DR
J_A28 N027 !Reg_Q0 0 DR
R34 VDD N027 50k
J_A29 VDD N027 P039 DR
R35 P039 Reg_Q0 1k
R36 Reg_Q0 VSS 4.5k
J_A30 P036 !InvertReg 0 DR
J_B12 P038 !Reg_0 0 DR
J_A31 N022 Reg_2 P040 DR
R37 VDD N022 100k
J_F9 VDD N022 P041 DR
R38 P041 !Reg_Q2 1k
R39 !Reg_Q2 VSS 4.8k
J_B13 N022 InvertReg P042 DR
J_A32 N025 !Reg_Q2 0 DR
R40 VDD N025 50k
J_A33 VDD N025 P043 DR
R41 P043 Reg_Q2 1k
R42 Reg_Q2 VSS 4.5k
J_A34 P040 !InvertReg 0 DR
J_B14 P042 !Reg_2 0 DR
.model NJF NJF
.model PJF PJF
.lib standard.jft
.backanno
.end